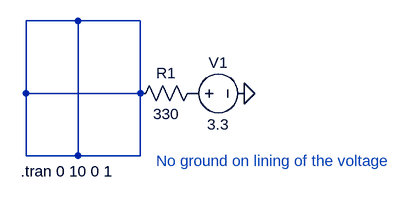
[diagram p0: schematic plain_format_test.asc]
plain_format_test.asc, the LTspice schematic file:
Version 4
SHEET 1 880 680
WIRE 48 64 -32 64
WIRE 144 64 48 64
WIRE -32 176 -32 64
WIRE 144 176 144 64
WIRE 144 176 -32 176
WIRE -32 272 -32 176
WIRE 48 272 48 64
WIRE 48 272 -32 272
WIRE 144 272 144 176
WIRE 144 272 48 272
FLAG 304 176 0
SYMBOL voltage 208 176 R270
WINDOW 0 32 56 VTop 2
WINDOW 3 -32 56 VBottom 2
WINDOW 123 0 0 Left 0
WINDOW 39 0 0 Left 0
SYMATTR InstName V1
SYMATTR Value 3.3
SYMBOL res 240 160 R90
WINDOW 0 0 56 VBottom 2
WINDOW 3 32 56 VTop 2
SYMATTR InstName R1
SYMATTR Value 330
TEXT -40 296 Left 2 !.tran 0 10 0 1
TEXT 168 280 Left 2 ;No ground on lining of the voltage

The netlist it stands for:
* plain_format_test.asc
V1 P001 0 3.3
R1 P001 N001 330
.tran 0 10 0 1
* No ground on lining of the voltage
.backanno
.end